# Altium project tree.PrjPcb
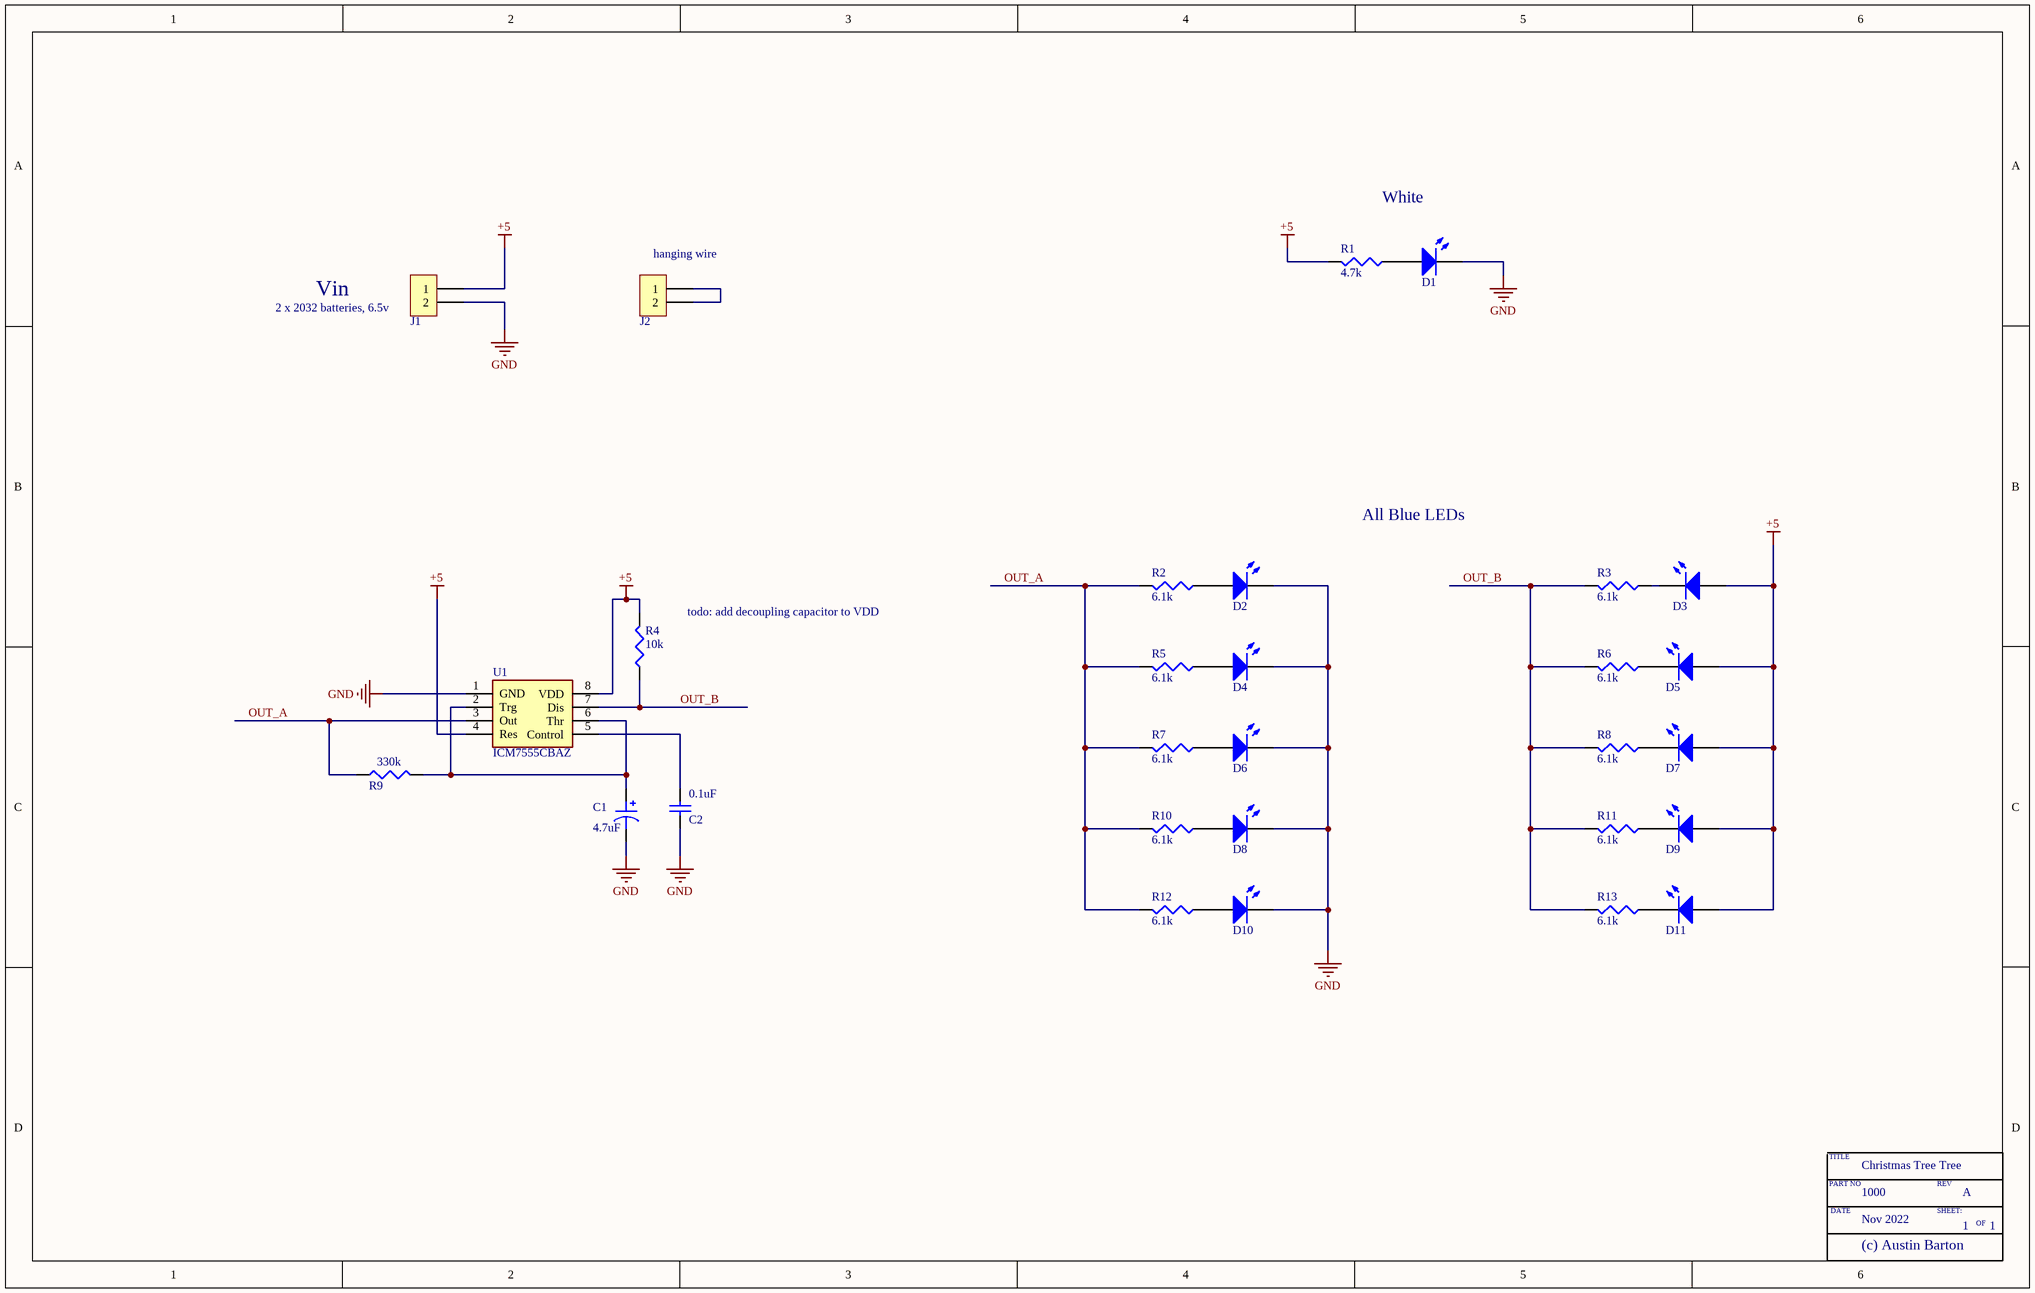
[diagram p0: tree.SchDoc]
1 sheet, 29 parts. Net scope: global (net labels, ports and power ports of the same name join across sheets).
Board file: tree.PcbDoc

## Sheet tree.SchDoc
size B; DrawnBy: --; SheetNumber: 1; SheetTotal: 1; DocumentFullPathAndName: --; ProjectName: --

### Parts
C1  4.7uF  [th_cap]
C2  0.1uF  [CAPC2012X09M]
D1  APT2012SURCK  [LED_0805_A_K]  (value not drawn)
D2  APT2012SURCK  [LED_0805_A_K]  (value not drawn)
D3  APT2012SURCK  [LED_0805_A_K]  (value not drawn)
D4  APT2012SURCK  [LED_0805_A_K]  (value not drawn)
D5  APT2012SURCK  [LED_0805_A_K]  (value not drawn)
D6  APT2012SURCK  [LED_0805_A_K]  (value not drawn)
D7  APT2012SURCK  [LED_0805_A_K]  (value not drawn)
D8  APT2012SURCK  [LED_0805_A_K]  (value not drawn)
D9  APT2012SURCK  [LED_0805_A_K]  (value not drawn)
D10  APT2012SURCK  [LED_0805_A_K]  (value not drawn)
D11  APT2012SURCK  [LED_0805_A_K]  (value not drawn)
J1  (no value)  [th_cap]
J2  (no value)  [th_cap]
R1  4.7k  [RESC2012X06L65]
R2  6.1k  [RESC2012X06L65]
R3  6.1k  [RESC2012X06L65]
R4  10k  [RESC2012X06L65]
R5  6.1k  [RESC2012X06L65]
R6  6.1k  [RESC2012X06L65]
R7  6.1k  [RESC2012X06L65]
R8  6.1k  [RESC2012X06L65]
R9  330k  [RESC2012X06L65]
R10  6.1k  [RESC2012X06L65]
R11  6.1k  [RESC2012X06L65]
R12  6.1k  [RESC2012X06L65]
R13  6.1k  [RESC2012X06L65]
U1  ICM7555CBAZ  [ICM7555CBAZ]

### Nets
+5: D3.1(A) D5.1(A) D7.1(A) D9.1(A) D11.1(A) J1.1 R1.2 R4.2 U1.4(Res) U1.8(VDD)
GND: C1.2 C2.1 D1.2(K) D2.2(K) D4.2(K) D6.2(K) D8.2(K) D10.2(K) J1.2 U1.1(GND)
OUT_A: R2.2 R5.2 R7.2 R9.1 R10.2 R12.2 U1.3(Out)
OUT_B: R3.2 R4.1 R6.2 R8.2 R11.2 R13.2 U1.7(Dis)
NetC1_1: C1.1 R9.2 U1.2(Trg) U1.6(Thr)
NetC2_2: C2.2 U1.5(Control)
NetD1_1: D1.1(A) R1.1
NetD2_1: D2.1(A) R2.1
NetD3_2: D3.2(K) R3.1
NetD4_1: D4.1(A) R5.1
NetD5_2: D5.2(K) R6.1
NetD6_1: D6.1(A) R7.1
NetD7_2: D7.2(K) R8.1
NetD8_1: D8.1(A) R10.1
NetD9_2: D9.2(K) R11.1
NetD10_1: D10.1(A) R12.1
NetD11_2: D11.2(K) R13.1
NetJ2_1: J2.1 J2.2

### Notes on the sheet
- White
- Vin
- (near J2) hanging wire
- (near J1) 2 x 2032 batteries, 6.5v
- All Blue LEDs
- (near R4) todo: add decoupling capacitor to VDD
- Christmas Tree Tree
- 1000
- Nov 2022
- A
- TITLE
- PART NO
- DATE
- REV
- SHEET:
- OF
- (c) Austin Barton

### Library data of the parts
C1 = th_cap: SMT Polarised Capacitor
C2 = C0805C180J5GACTU: 0.1pF 50V Ceramic Capacitor C0G, NP0 0805 (2012 Metric); Manufacturer: Kemet; Value: 18pF; Tolerance: ±5%; Part Number: C0805C180J5GACTU; Category: Capacitors; Manufacturer Part Number: C0805C180J5GACTU; Supplier 1: Digi-Key; Supplier Part Number 1: 399-1112-1-ND; Voltage: 50V; Dielectric: C0G, NP0; Price(qty 1000): 0.02040; Footprint: 0805 (2012 Metric); RoHS: RoHS Compliant; ComponentLink1Description: Datasheet; ComponentLink1URL: http://www.kemet.com/Lists/ProductCatalog/Attachments/46/KEM_C1003_C0G_SMD.pdf; Operating Temperature: -55°C ~ 125°C; Package: 0805 (2012 Metric)
D1-D11 = APT2012SURCK: LED RED CLEAR 0805 SMD; Manufacturer: Kingbright; Vf: 1.95V; Current - Test: 20mA; Viewing Angle: 120°; Millicandela Rating: 80mcd; Lens Color: Colorless; Part Number: APT2012SURCK; Category: LED; Manufacturer Part Number: APT2012SURCK; Supplier 1: Digi-Key; Supplier Part Number 1: 754-1133-1-ND; Price(qty 1000): 0.08349; RoHS: Lead free / RoHS Compliant; ComponentLink1Description: Datasheet; ComponentLink1URL: http://www.kingbrightusa.com/images/catalog/SPEC/APT2012SURCK.pdf; Mounting Type: Surface Mount; Package: 0805 (2012 Metric); Color: Red; Lens Transparency: Clear; Height (Max): 0.75mm
J1 J2 = HDR1x2: 2 PIN HEADER TIN
R1-R13 = RC0805FR-07120RL: RES SMD 1% 1/8W 0805; Manufacturer: Yageo; Power: 0.125W, 1/8W; Value: 120; Temperature Coefficient: ±100ppm/°C; Part Number: RC0805FR-07120RL; Category: Resistors; Footprint: 0805 (2012 Metric); Manufacturer Part Number: RC0805FR-07120RL; Supplier 1: Digi-Key; Supplier Part Number 1: 311-120CRCT-ND; Price(qty 1000): 0.00379; RoHS: RoHS Compliant; ComponentLink1Description: http://www.yageo.com/documents/recent/PYu-RC_Group_51_RoHS_L_04.pdf; ComponentLink1URL: http://www.yageo.com/documents/recent/PYu-RC_Group_51_RoHS_L_04.pdf; Tolerance: ±1%; Operating Temperature: -55°C ~ 155°C; Composition: Thick Film; Features: Moisture Resistant; Size / Dimension: 0.079" L x 0.049" W (2.00mm x 1.25mm); Height: 0.024" (0.60mm); Package: 0805 (2012 Metric)
U1 = ICM7555CBAZ: Timers & Support Products GEN PURPSE CMOS TIMR COM; MP: USB-A1VSB6; MF: On Shore; Package: None; Price: None; Value: *; SnapEDA_Link: https://www.snapeda.com/parts/USB-A1VSB6/On%20Shore%20Technology%20Inc./view-part/481020/?ref=snap; Availability: Unavailable